# EAGLE schematic ov7670_arduino (EAGLE 8.5.2)
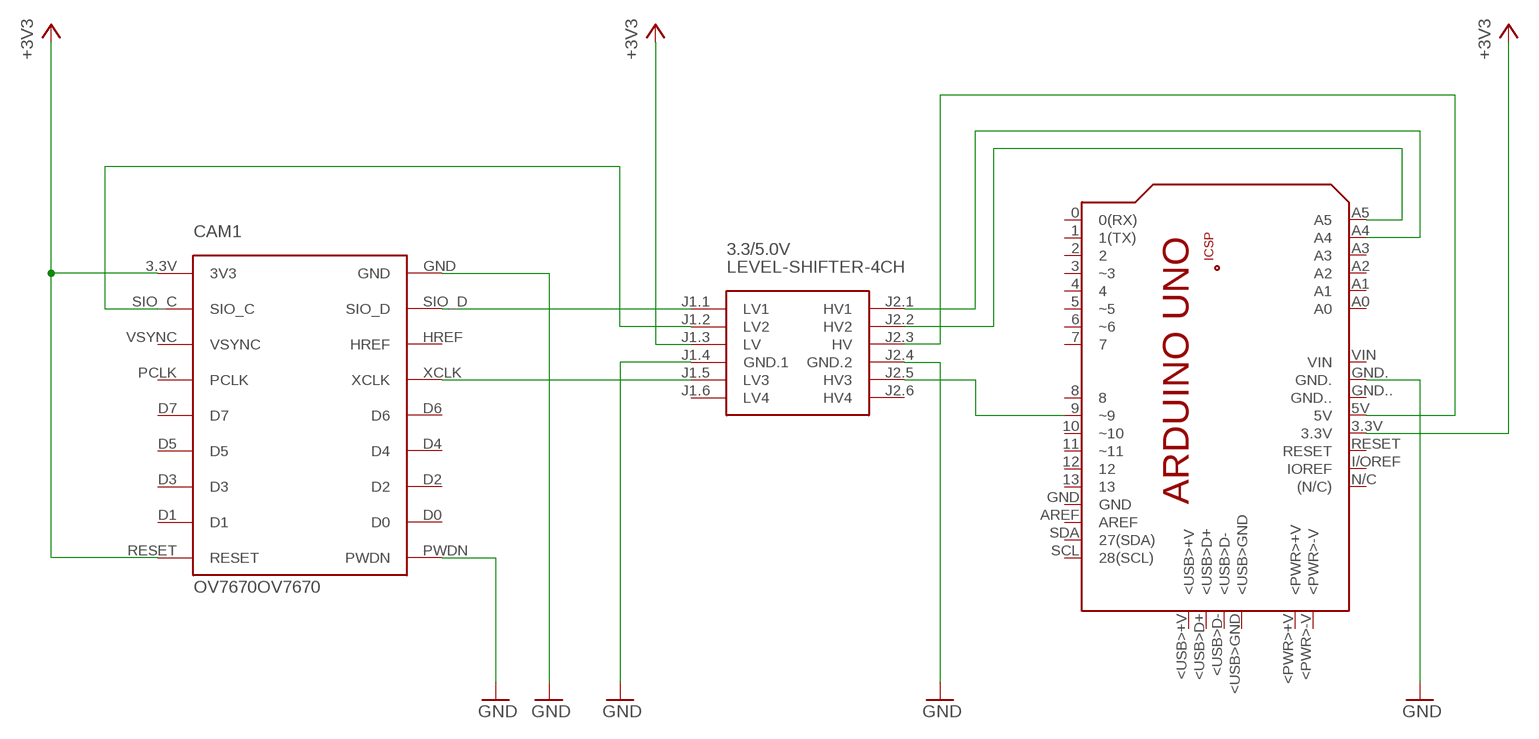
[diagram p0: schematic, sheet 1]

## Parts
3.3/5.0V  LEVEL-SHIFTER-4CH  [LEVEL-SHIFTER-4CH]
CAM1  OV7670OV7670  [18PIN]
PCB1  ARDUINO_UNO  [ARDUINO_UNO]
U$1  OV7670OV7670  [18PIN]  (not placed on a sheet)

## Nets
+3V3: 3.3/5.0V.J1.3(LV) CAM1.3.3V(3V3) CAM1.RESET PCB1.3.3V
GND: 3.3/5.0V.J1.4(GND.1) 3.3/5.0V.J2.4(GND.2) CAM1.GND CAM1.PWDN PCB1.GND.
N$1: 3.3/5.0V.J2.3(HV) PCB1.5V
N$2: 3.3/5.0V.J1.5(LV3) CAM1.XCLK
N$3: 3.3/5.0V.J2.5(HV3) PCB1.9(~9)
N$4: 3.3/5.0V.J2.2(HV2) PCB1.A5
N$5: 3.3/5.0V.J2.1(HV1) PCB1.A4
N$6: 3.3/5.0V.J1.2(LV2) CAM1.SIO_C
N$7: 3.3/5.0V.J1.1(LV1) CAM1.SIO_D
Unconnected: 3.3/5.0V.J1.6(LV4) 3.3/5.0V.J2.6(HV4) CAM1.D0 CAM1.D1 CAM1.D2 CAM1.D3 CAM1.D4 CAM1.D5 CAM1.D6 CAM1.D7 CAM1.HREF CAM1.PCLK CAM1.VSYNC PCB1.0(0(RX)) PCB1.1(1(TX)) PCB1.2 PCB1.3(~3) PCB1.4 PCB1.5(~5) PCB1.6(~6) PCB1.7 PCB1.8 PCB1.10(~10) PCB1.11(~11) PCB1.12 PCB1.13 PCB1.+5V PCB1.<PWR>+V PCB1.<PWR>-V PCB1.<USB>+V PCB1.<USB>D+ PCB1.<USB>D- PCB1.<USB>GND PCB1.A0 PCB1.A1 PCB1.A2 PCB1.A3 PCB1.AREF PCB1.GND PCB1.GND.. PCB1.GND_ PCB1.I/OREF(IOREF) PCB1.MISO PCB1.MOSI PCB1.N/C((N/C)) PCB1.RESET PCB1.RESET. PCB1.SCK PCB1.SCL(28(SCL)) PCB1.SDA(27(SDA)) PCB1.VIN U$1.D0 U$1.D1 U$1.D2 U$1.D3 U$1.D4 U$1.D5 U$1.D6 U$1.D7 U$1.HREF U$1.PCLK U$1.PWDN U$1.RESET U$1.SIO_C U$1.SIO_D U$1.VSYNC U$1.XCLK

## Power pins joined to a net without a drawn wire
3V3: U$1.3.3V(3V3)
GND: U$1.GND

## Library data of the parts
3.3/5.0V = diy-modules:LEVEL-SHIFTER-4CH: 4-Channel Bi-Directional Logic Level Converter based on BSS128 transistors Click here to find device on ebay.com <http://www.ebay.com/sch/i2c+logic+converter+module>
CAM1 U$1 = ov7670:OV7670
PCB1 = E14_Arduino_revC:ARDUINO_UNO: Device for representing an Arduino Uno board with a footprint in an EAGLE design. Created by Dave Young for Element14. More EAGLE documentation at: http://www.element14.com/community/community/knode/cadsoft_eagle